# EasyEDA Pro project ProProject_Hauptplatine_ESP32.epro, schematic Ausgelagert
Create Date: 2024-05-03; Page Name: P1; Project Name: Hauptplatine_ESP32; Schematic Name: Ausgelagert; Update Date: 2024-05-03; Company: EasyEDA.com; Drawn: EasyEDA; Page Size: A4; Part Number: JLCPCB-002; Reviewed: EasyEDA; Version: V0.1
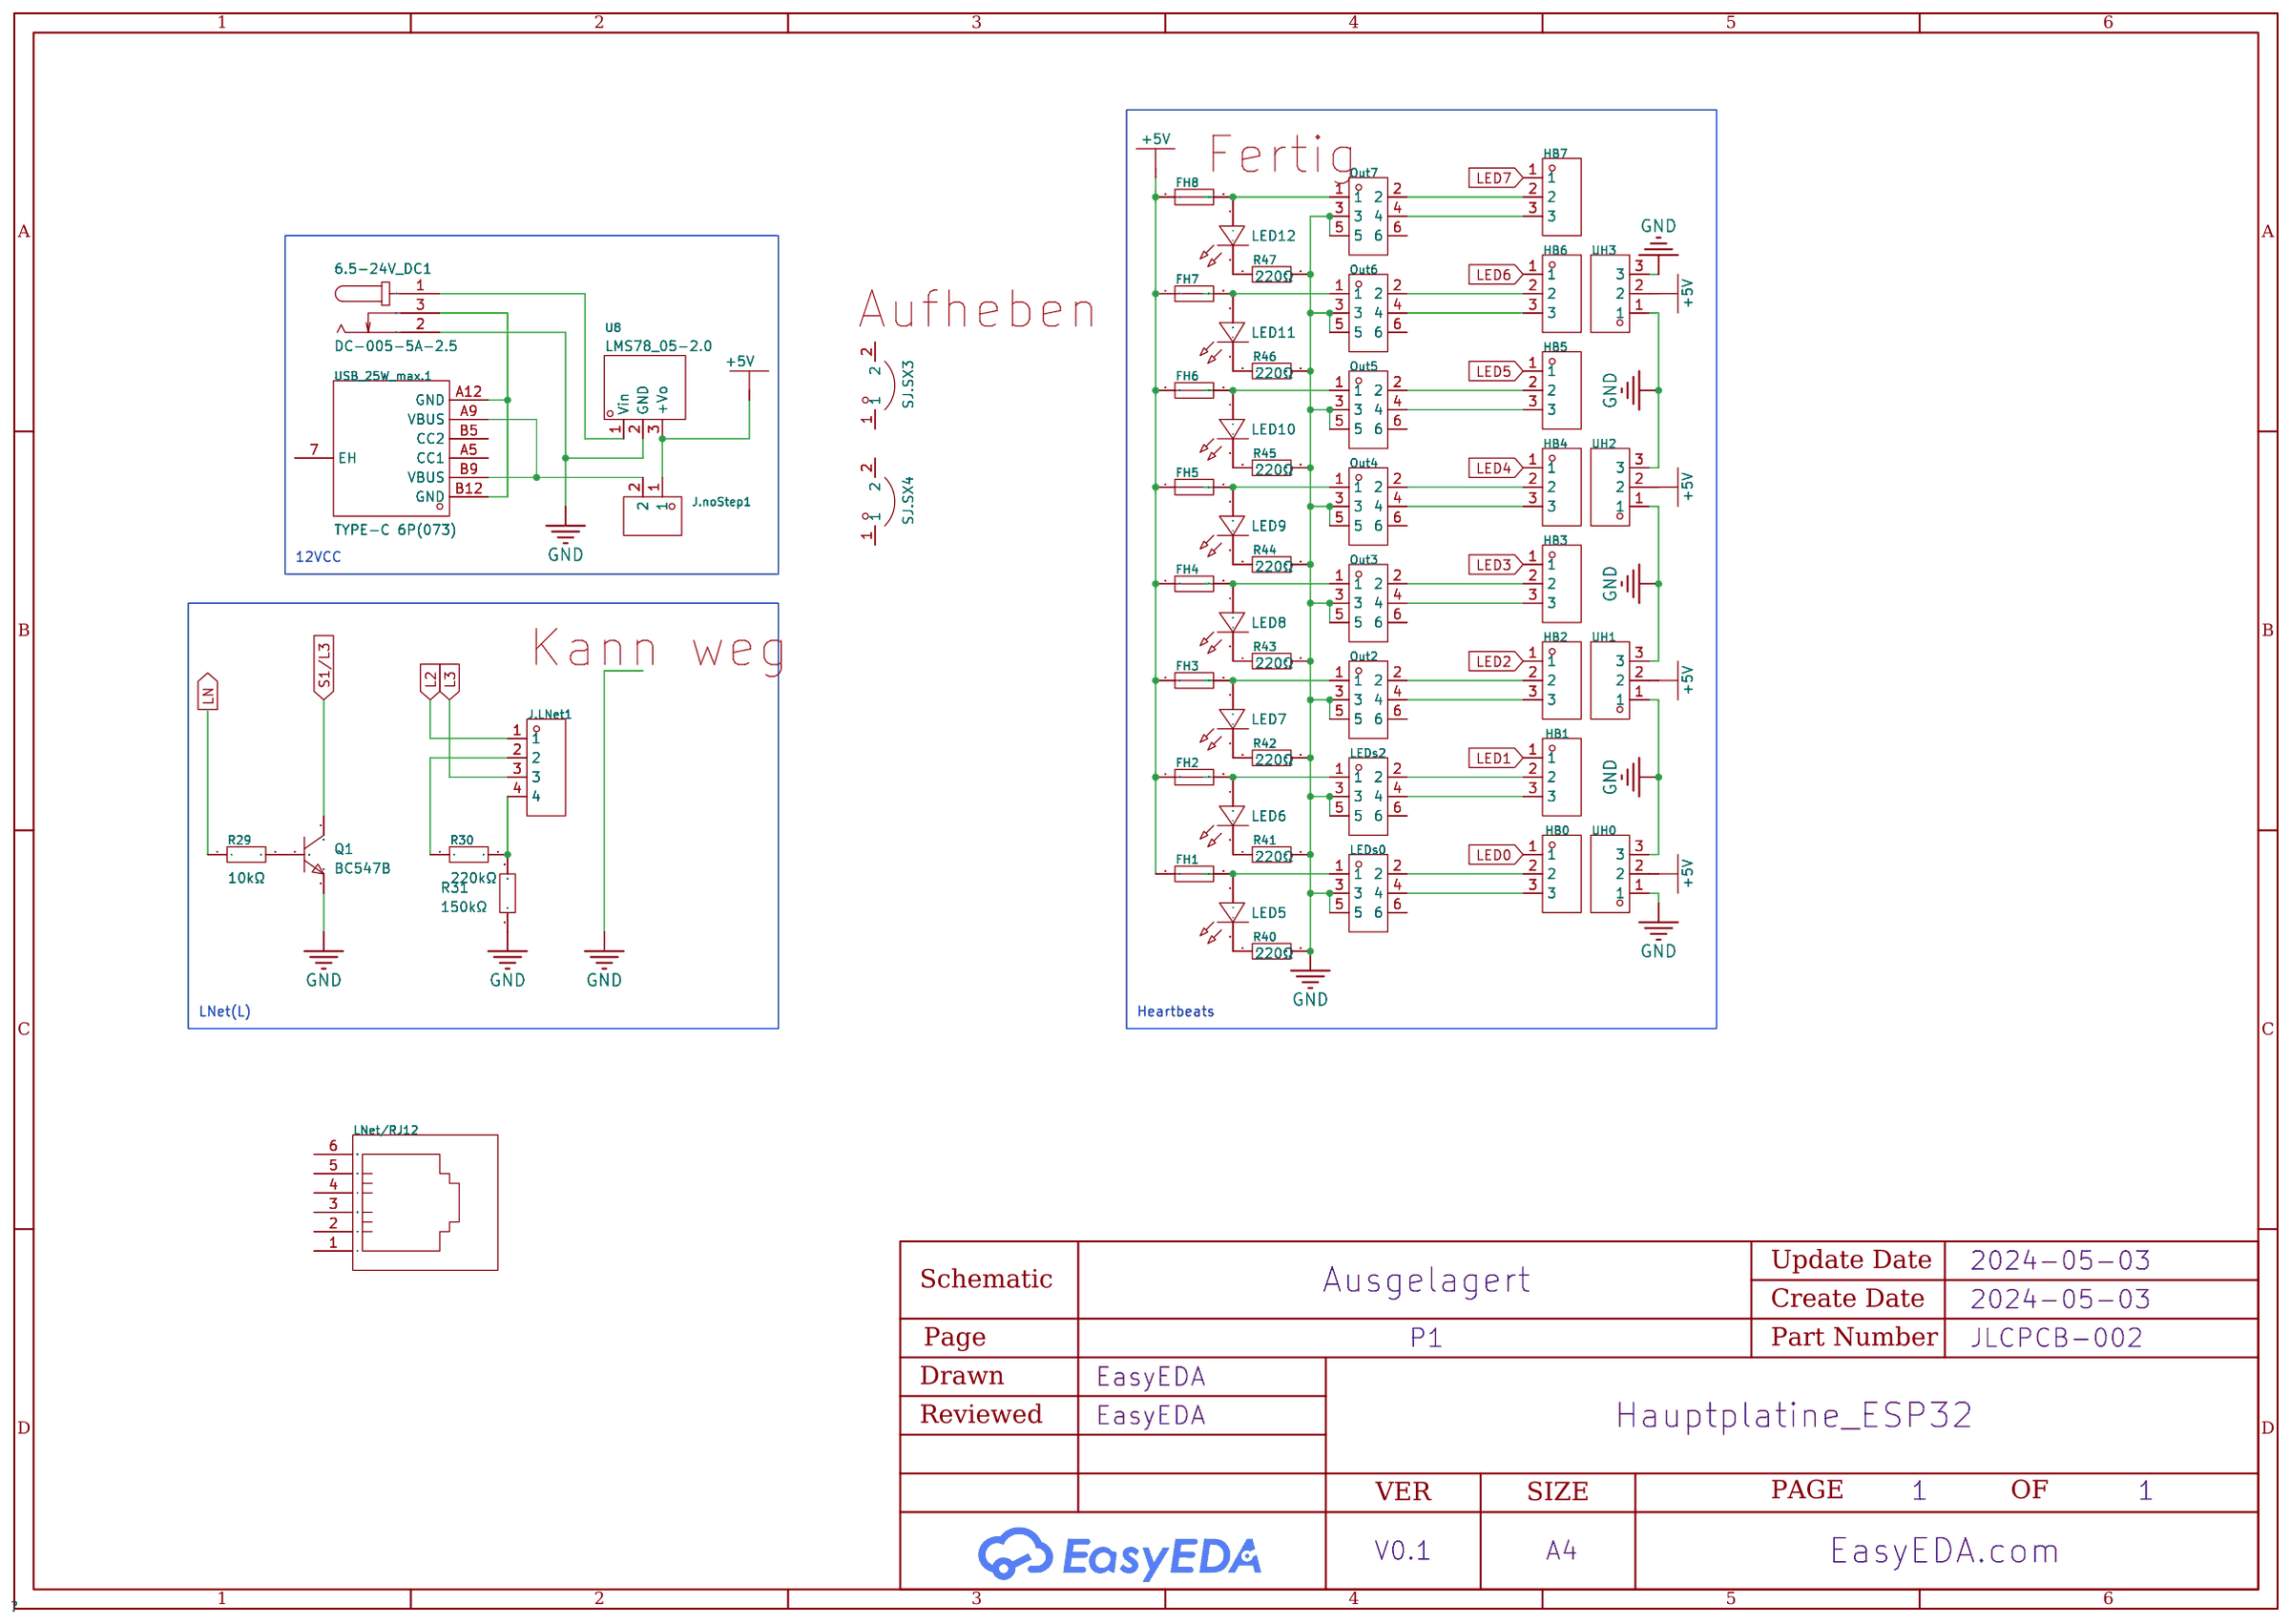
[diagram p6: schematic sheet]

## Parts
6.5-24V_DC1  DC-005-5A-2.5  [DC-IN-TH_DC-005-5A-2.5]
FH1  01550900M  [FUSE-SMD_L9.8-W5.0]
FH2  01550900M  [FUSE-SMD_L9.8-W5.0]
FH3  01550900M  [FUSE-SMD_L9.8-W5.0]
FH4  01550900M  [FUSE-SMD_L9.8-W5.0]
FH5  01550900M  [FUSE-SMD_L9.8-W5.0]
FH6  01550900M  [FUSE-SMD_L9.8-W5.0]
FH7  01550900M  [FUSE-SMD_L9.8-W5.0]
FH8  01550900M  [FUSE-SMD_L9.8-W5.0]
HB0  PM2.54-1*3  [HDR-TH_3P-P2.54-V-F]
HB1  PM2.54-1*3  [HDR-TH_3P-P2.54-V-F]
HB2  PM2.54-1*3  [HDR-TH_3P-P2.54-V-F]
HB3  PM2.54-1*3  [HDR-TH_3P-P2.54-V-F]
HB4  PM2.54-1*3  [HDR-TH_3P-P2.54-V-F]
HB5  PM2.54-1*3  [HDR-TH_3P-P2.54-V-F]
HB6  PM2.54-1*3  [HDR-TH_3P-P2.54-V-F]
HB7  PM2.54-1*3  [HDR-TH_3P-P2.54-V-F]
J.LNet1  PZ254V-11-04P  [HDR-TH_4P-P2.54-V-M]
J.noStep1  PZ254V-11-02P  [HDR-TH_2P-P2.54-V-M]
LED5  SZYY1206G  [LED1206-R-RD]
LED6  SZYY1206G  [LED1206-R-RD]
LED7  SZYY1206G  [LED1206-R-RD]
LED8  SZYY1206G  [LED1206-R-RD]
LED9  SZYY1206G  [LED1206-R-RD]
LED10  SZYY1206G  [LED1206-R-RD]
LED11  SZYY1206G  [LED1206-R-RD]
LED12  SZYY1206G  [LED1206-R-RD]
LEDs0  BH254V-6P  [IDC-TH_6P-P2.54-V-R2-C3-S2.54]
LEDs2  BH254V-6P  [IDC-TH_6P-P2.54-V-R2-C3-S2.54]
LNet/RJ12  DS1133-S60BPX  [RJ11-TH_DS1133-S60BPX]
Out2  BH254V-6P  [IDC-TH_6P-P2.54-V-R2-C3-S2.54]
Out3  BH254V-6P  [IDC-TH_6P-P2.54-V-R2-C3-S2.54]
Out4  BH254V-6P  [IDC-TH_6P-P2.54-V-R2-C3-S2.54]
Out5  BH254V-6P  [IDC-TH_6P-P2.54-V-R2-C3-S2.54]
Out6  BH254V-6P  [IDC-TH_6P-P2.54-V-R2-C3-S2.54]
Out7  BH254V-6P  [IDC-TH_6P-P2.54-V-R2-C3-S2.54]
Q1  BC547B  [TO-92-3_L4.9-W3.7-P1.27-L]
R29  10kΩ  [R1206]
R30  220kΩ  [R1206]
R31  150kΩ  [R1206]
R40  220Ω  [R1206]
R41  220Ω  [R1206]
R42  220Ω  [R1206]
R43  220Ω  [R1206]
R44  220Ω  [R1206]
R45  220Ω  [R1206]
R46  220Ω  [R1206]
R47  220Ω  [R1206]
SJ.SX3  SJ_1.27  [SMD_2P-P1.27-SJ]
SJ.SX4  SJ_1.27  [SMD_2P-P1.27-SJ]
U8  LMS78_05-2.0  [PWRM-TH_K78XX-500R3]
UH0  PM2.54-1*3  [HDR-TH_3P-P2.54-V-F]
UH1  PM2.54-1*3  [HDR-TH_3P-P2.54-V-F]
UH2  PM2.54-1*3  [HDR-TH_3P-P2.54-V-F]
UH3  PM2.54-1*3  [HDR-TH_3P-P2.54-V-F]
USB_25W_max.1  TYPE-C 6P(073)  [TYPE-C-SMD_TYPE-C-6P]

## Library data of the parts
6.5-24V_DC1 = DC-005-5A-2.5: Connector Type:DC Power Receptacle Inside Contact Diameter:2.5mm Outside Contact Diameter:6.5mm Current Rating (Max):5A Voltage Rating (Max):24V Contact Material:Brass Operating Temperature Range:-20℃~+70℃ Operating Temperature Range:-20℃~+70℃ Soldering T; LCSC Part Name: DC电源插座 内径:2.5mm 外径:6.5mm; Supplier Part: C381115; Manufacturer: XKB Connectivity(中国星坤); Supplier Footprint: 插件; JLCPCB Part Class: Extended Part; Datasheet: https://atta.szlcsc.com/upload/public/pdf/source/20220930/9F6B678D272419D8FE16D336E354A545.pdf; Supplier: LCSC; Connector Type: DC Power Receptacle; Inside Contact Diameter: 2.5mm; Outside Contact Diameter: 6.5mm; Current Rating (Max): 5A; Voltage Rating (Max): 24V; Contact Material: Brass; Operating Temperature Range: -20℃~+70℃; Soldering Temperature(Max): 260℃
FH1-FH8 = 01550900M: Fuseholder Type:- Fuse Type:- Fuse Size:-; Supplier Part: C108518; Manufacturer: Littelfuse(美国力特); Supplier Footprint: SMD,5.0x9.7mm; JLCPCB Part Class: Extended Part; Datasheet: https://atta.szlcsc.com/upload/public/pdf/source/20181031/C315847_D8C8759CD5ED576C0EA975A2D5312378.pdf; Supplier: LCSC
HB0-HB7 UH0-UH3 = PM2.54-1*3: Holes Structure:1x3P Pitch:2.54mm Row Spacing:2.54mm Circular Hole / Square Hole:方孔 Mounting Type:Straight Number of Rows:Plugin Number of Holes:3P Current Rating (Max):2.5A Holes Direction:Top Insulation Height:8.5mm Operating Temperature Range:-40℃~+105; LCSC Part Name: 间距:2.54mm 1x3P 直插; Supplier Part: C5116529; Manufacturer: ZHOURI(洲日); Supplier Footprint: 插件,P=2.54mm; JLCPCB Part Class: Extended Part; Datasheet: https://atta.szlcsc.com/upload/public/pdf/source/20220729/0B9CDCB2053AD78CED9CDFEF888323E9.pdf; Supplier: LCSC; Holes Structure: 1x3P; Pitch: 2.54mm; Row Spacing: 2.54mm; Circular Hole / Square Hole: 方孔; Mounting Type: Straight; Number of Rows: Plugin; Number of Holes: 3P; Current Rating (Max): 2.5A; Holes Direction: Top; Insulation Height: 8.5mm; Operating Temperature Range: -40℃~+105℃
J.LNet1 = PZ254V-11-04P: Pin Structure:1x4P Pitch:2.54mm Row Spacing:- Circluar Pins/Square Pins:Square Pins Mounting Type:Straight Number of Rows:Plugin Number of Pins:4P Current Rating (Max):3A Voltage Rating (Max):250V Length of Mating Pin:6mm Insulation Height:2.5mm Length of; LCSC Part Name: 间距:2.54mm 1x4P 直插 方针; Supplier Part: C2691448; Manufacturer: XFCN(兴飞); Supplier Footprint: 插件,P=2.54mm; JLCPCB Part Class: Extended Part; Datasheet: https://atta.szlcsc.com/upload/public/pdf/source/20200309/C492403_F9F19131791D08044AD4F84F8E751A34.pdf; Supplier: LCSC; Pin Structure: 1x4P; Pitch: 2.54mm; Circluar Pins/Square Pins: Square Pins; Mounting Type: Straight; Number of Rows: Plugin; Number of Pins: 4P; Current Rating (Max): 3A; Voltage Rating (Max): 250V; Length of Mating Pin: 6mm; Insulation Height: 2.5mm; Length of End Connection Pin: 3mm; Operating Temperature Range: -40℃~+105℃; Color: Black
J.noStep1 = PZ254V-11-02P: Pin Structure:1x2P Pitch:2.54mm Row Spacing:- Circluar Pins/Square Pins:Square Pins Mounting Type:Straight Number of Rows:Plugin Number of Pins:2P Current Rating (Max):- Voltage Rating (Max):- Length of Mating Pin:6mm Insulation Height:2.5mm Length of End; LCSC Part Name: 间距:2.54mm 1x2P 直插 方针; Supplier Part: C492401; Manufacturer: XFCN(兴飞); Supplier Footprint: 插件,P=2.54mm; JLCPCB Part Class: Extended Part; Datasheet: https://atta.szlcsc.com/upload/public/pdf/source/20200309/C492401_A812433581A9B211A7FFA413ADDFF0E5.pdf; Supplier: LCSC; Pin Structure: 1x2P; Pitch: 2.54mm; Circluar Pins/Square Pins: Square Pins; Mounting Type: Straight; Number of Rows: Plugin; Number of Pins: 2P; Length of Mating Pin: 6mm; Insulation Height: 2.5mm; Length of End Connection Pin: 3mm; Operating Temperature Range: -40℃~+105℃; Color: Black
LED5-LED12 = SZYY1206G: Emitted Color:Emerald; LCSC Part Name: 翠绿; Supplier Part: C434439; Manufacturer: yongyu(永裕光电); Supplier Footprint: 1206; JLCPCB Part Class: Extended Part; Datasheet: https://atta.szlcsc.com/upload/public/pdf/source/20200628/C434439_0A6287F1EA2604FB8C8003896F01CB92.pdf; Supplier: LCSC; Emitted Color: Emerald
LEDs0 LEDs2 Out2-Out7 = BH254V-6P: Connector Type:简牛座 Pitch:2.54mm Structure:2x3P Current Rating (Max):3A Voltage Rating (Max):250V Holder Type:Straight Row Spacing:2.54mm Number of Rows:2 Pin Number in each Row:3 Operating Temperature Range:-40℃~+105℃ Operating Temperature Range:-40℃~+105; LCSC Part Name: 2.54mm 2x3P 排数:2 每排P数:3; Supplier Part: C492441; Manufacturer: XFCN(兴飞); Supplier Footprint: 插件,P=2.54mm; JLCPCB Part Class: Extended Part; Datasheet: https://atta.szlcsc.com/upload/public/pdf/source/20200312/C492444_4AABE2FC4F6BE8226B85135616AF0092.pdf; Supplier: LCSC; Connector Type: 简牛座; Pitch: 2.54mm; Structure: 2x3P; Current Rating (Max): 3A; Voltage Rating (Max): 250V; Holder Type: Straight; Row Spacing: 2.54mm; Number of Rows: 2; Pin Number in each Row: 3; Operating Temperature Range: -40℃~+105℃
LNet/RJ12 = DS1133-S60BPX: Connector Type:RJReceptacle USOC Codes:RJ12 Number of Ports:1 Shielding:- LED:- Ratings:-; LCSC Part Name: RJ12; Supplier Part: C77859; Manufacturer: CONNFLY; Supplier Footprint: 插件; JLCPCB Part Class: Extended Part; Datasheet: https://atta.szlcsc.com/upload/public/pdf/source/20180529/C77859_3164FC81ACC4F2D8B15A2684EF7DB4A9.pdf; Supplier: LCSC; Connector Type: RJReceptacle; USOC Codes: RJ12; Number of Ports: 1
Q1 = BC547B_C719806: Transistor Type: Collector Current (Ic): Collector-Emitter Breakdown Voltage (Vceo): Power Dissipation (Pd): DC Current Gain (hFE@Ic,Vce):200@2mA,5V DC Current Gain (hFE@Ic,Vce):200@2mA,5V Transition Frequency (fT):300MHz Collector Cut-Off Current (Icbo):; LCSC Part Name: 耐压:45V 电流:100mA NPN; Supplier Part: C719806; Manufacturer: onsemi(安森美); Supplier Footprint: TO-92-3; JLCPCB Part Class: Extended Part; Datasheet: https://atta.szlcsc.com/upload/public/pdf/source/20230915/4ABAAE35BBE891E62B9F2D68DC6BA32E.pdf; Supplier: LCSC; DC Current Gain (hFE@Ic,Vce): 200@2mA,5V; Transition Frequency (fT): 300MHz; Collector Cut-Off Current (Icbo): 15nA; Collector-Emitter Saturation Voltage (VCE(sat)@Ic,Ib): 600mV@5mA,100mA; Operating Temperature: -55℃~+150℃@(Tj)
R29 = 1206W4F1002T5E: Type:Thick Film Resistors Resistance:10kΩ Tolerance:±1% Tolerance:±1% Power(Watts): Overload Voltage (Max): Temperature Coefficient:±100ppm/℃ Temperature Coefficient:±100ppm/℃ Operating Temperature Range:-55℃~+155℃ Operating Temperature Range:-55℃~+155℃; LCSC Part Name: 10kΩ ±1% 250mW 厚膜电阻; Supplier Part: C17902; Manufacturer: UNI-ROYAL(厚声); Supplier Footprint: 1206; JLCPCB Part Class: Basic Part; Datasheet: https://atta.szlcsc.com/upload/public/pdf/source/20200306/C422600_1E6D84923E4A46A82E41ADD87F860B5C.pdf; Supplier: LCSC; Type: Thick Film Resistors; Tolerance: ±1%; Temperature Coefficient: ±100ppm/℃; Operating Temperature Range: -55℃~+155℃
R30 = 1206W4F2203T5E: Type:Thick Film Resistors Resistance:220kΩ Tolerance:±1% Tolerance:±1% Power(Watts): Overload Voltage (Max): Temperature Coefficient:±100ppm/℃ Temperature Coefficient:±100ppm/℃ Operating Temperature Range:-55℃~+155℃ Operating Temperature Range:-55℃~+155℃; LCSC Part Name: 220kΩ ±1% 250mW 厚膜电阻; Supplier Part: C17956; Manufacturer: UNI-ROYAL(厚声); Supplier Footprint: 1206; JLCPCB Part Class: Extended Part; Datasheet: https://atta.szlcsc.com/upload/public/pdf/source/20200306/C422600_1E6D84923E4A46A82E41ADD87F860B5C.pdf; Supplier: LCSC; Type: Thick Film Resistors; Tolerance: ±1%; Temperature Coefficient: ±100ppm/℃; Operating Temperature Range: -55℃~+155℃
R31 = 1206W4F1503T5E: Type:Thick Film Resistors Resistance:150kΩ Tolerance:±1% Tolerance:±1% Power(Watts): Overload Voltage (Max): Temperature Coefficient:±100ppm/℃ Temperature Coefficient:±100ppm/℃ Operating Temperature Range:-55℃~+155℃ Operating Temperature Range:-55℃~+155℃; LCSC Part Name: 150kΩ ±1% 250mW 厚膜电阻; Supplier Part: C17916; Manufacturer: UNI-ROYAL(厚声); Supplier Footprint: 1206; JLCPCB Part Class: Extended Part; Datasheet: https://atta.szlcsc.com/upload/public/pdf/source/20200306/C422600_1E6D84923E4A46A82E41ADD87F860B5C.pdf; Supplier: LCSC; Type: Thick Film Resistors; Tolerance: ±1%; Temperature Coefficient: ±100ppm/℃; Operating Temperature Range: -55℃~+155℃
R40-R47 = 1206W4J0221T5E: Type:Thick Film Resistors Resistance: Tolerance:±5% Tolerance:±5% Power(Watts): Overload Voltage (Max): Temperature Coefficient:±100ppm/℃ Temperature Coefficient:±100ppm/℃ Operating Temperature Range:-55℃~+155℃ Operating Temperature Range:-55℃~+155℃; LCSC Part Name: 220Ω ±5% 250mW 厚膜电阻; Supplier Part: C25363; Manufacturer: UNI-ROYAL(厚声); Supplier Footprint: 1206; JLCPCB Part Class: Extended Part; Datasheet: https://atta.szlcsc.com/upload/public/pdf/source/20200306/C422600_1E6D84923E4A46A82E41ADD87F860B5C.pdf; Supplier: LCSC; Type: Thick Film Resistors; Tolerance: ±5%; Temperature Coefficient: ±100ppm/℃; Operating Temperature Range: -55℃~+155℃
SJ.SX3 SJ.SX4 = SJ-raily74: Pin Structure:1x2P Pitch:1.27mm Row Spacing:1.27mm Circluar Pins/Square Pins:Square Pins Mounting Type:- Number of Rows:Plugin Number of Pins:2P Current Rating (Max):1A Voltage Rating (Max):250V Length of Mating Pin:1.8mm Insulation Height:1mm Length of E; LCSC Part Name: 1x2P 间距:1.27mm 方针; Supplier Part: C2881569; Manufacturer: XKB Connection(中国星坤); Supplier Footprint: SMD,P=1.27mm(交错脚); JLCPCB Part Class: Extended Part; Supplier: LCSC; Pin Structure: 1x2P; Pitch: 1.27mm; Row Spacing: 1.27mm; Circluar Pins/Square Pins: Square Pins; Number of Rows: Plugin; Number of Pins: 2P; Current Rating (Max): 1A; Voltage Rating (Max): 250V; Length of Mating Pin: 1.8mm; Insulation Height: 1mm; Length of End Connection Pin: 4.2mm; Contact Plating: Gold; Operating Temperature Range: -40℃~+105℃; Soldering Temperature(Max): 260℃; Color: Black
U8 = K7805-500R3_C909662: Conversion Type:DC-DC Input Voltage(DC):6V~36V Input Voltage(DC):6V~36V Output Voltage:5V Output Voltage:5V Output Current (Max):500mA Output Current (Max):500mA Function:- Output Channel:1; LCSC Part Name: K7805-500R3; Supplier Part: C909662; Manufacturer: DEXU(德旭电子); Manufacturer Part: K7805-500R3; Supplier Footprint: 插件; JLCPCB Part Class: Extended Part; Datasheet: https://atta.szlcsc.com/upload/public/pdf/source/20201117/C909662_B77209BD6C81EDDF768B71BCFC4F182D.pdf; Supplier: LCSC; Conversion Type: DC-DC; Input Voltage(DC): 6V~36V; Output Voltage: 5V; Output Current (Max): 500mA; Output Channel: 1
USB_25W_max.1 = TYPE-C 6P(073): Connector Type:Type-C Standard:- Gender:Female Number of Ports:1 Number of Contacts:6P Mounting Style:卧贴 Current Rating - Power (Max):5A Operating Temperature Range:-25℃~+85℃ Operating Temperature Range:-25℃~+85℃; LCSC Part Name: Type-C 母 卧贴; Supplier Part: C668623; Manufacturer: SHOU HAN(首韩); Supplier Footprint: SMD; JLCPCB Part Class: Extended Part; Datasheet: https://atta.szlcsc.com/upload/public/pdf/source/20200618/C668623_A4B260DED7AC1949BAC6AE39E9F4CD80.pdf; Supplier: LCSC; Connector Type: Type-C; Gender: Female; Number of Ports: 1; Number of Contacts: 6P; Mounting Style: 卧贴; Current Rating - Power (Max): 5A; Operating Temperature Range: -25℃~+85℃

## Nets
+5V: FH1.1 FH2.1 FH3.1 FH4.1 FH5.1 FH6.1 FH7.1 FH8.1 J.noStep1.1 U8.3(+Vo) UH0.2 UH1.2 UH2.2 UH3.2
GND: 6.5-24V_DC1.2 LEDs0.3 LEDs0.5 LEDs2.3 LEDs2.5 Out2.3 Out2.5 Out3.3 Out3.5 Out4.3 Out4.5 Out5.3 Out5.5 Out6.3 Out6.5 Out7.3 Out7.5 Q1.3(E) R31.1 R40.2 R41.2 R42.2 R43.2 R44.2 R45.2 R46.2 R47.2 U8.2(GND) UH0.1 UH0.3 UH1.1 UH1.3 UH2.1 UH2.3 UH3.1 UH3.3
L2: J.LNet1.1
L3: J.LNet1.3
LED0: HB0.1
LED1: HB1.1
LED2: HB2.1
LED3: HB3.1
LED4: HB4.1
LED5: HB5.1
LED6: HB6.1
LED7: HB7.1
LN: R29.1
S1/L3: Q1.1(C)
Net-(6.5-24V_DC1-1): 6.5-24V_DC1.1 U8.1(Vin)
Net-(6.5-24V_DC1-3): 6.5-24V_DC1.3 USB_25W_max.1.A12(GND) USB_25W_max.1.B12(GND)
Net-(FH1-2): FH1.2 LED5.1(+) LEDs0.1
Net-(FH2-2): FH2.2 LED6.1(+) LEDs2.1
Net-(FH3-2): FH3.2 LED7.1(+) Out2.1
Net-(FH4-2): FH4.2 LED8.1(+) Out3.1
Net-(FH5-2): FH5.2 LED9.1(+) Out4.1
Net-(FH6-2): FH6.2 LED10.1(+) Out5.1
Net-(FH7-2): FH7.2 LED11.1(+) Out6.1
Net-(FH8-2): FH8.2 LED12.1(+) Out7.1
Net-(HB0-2): HB0.2 LEDs0.2
Net-(HB0-3): HB0.3 LEDs0.4
Net-(HB1-2): HB1.2 LEDs2.2
Net-(HB1-3): HB1.3 LEDs2.4
Net-(HB2-2): HB2.2 Out2.2
Net-(HB2-3): HB2.3 Out2.4
Net-(HB3-2): HB3.2 Out3.2
Net-(HB3-3): HB3.3 Out3.4
Net-(HB4-2): HB4.2 Out4.2
Net-(HB4-3): HB4.3 Out4.4
Net-(HB5-2): HB5.2 Out5.2
Net-(HB5-3): HB5.3 Out5.4
Net-(HB6-2): HB6.2 Out6.2
Net-(HB6-3): HB6.3 Out6.4
Net-(HB7-2): HB7.2 Out7.2
Net-(HB7-3): HB7.3 Out7.4
Net-(J.LNet1-2): J.LNet1.2 R30.1
Net-(J.LNet1-4): J.LNet1.4 R30.2 R31.2
Net-(J.noStep1-2): J.noStep1.2 USB_25W_max.1.A9(VBUS) USB_25W_max.1.B9(VBUS)
Net-(LED5-2): LED5.2(-) R40.1
Net-(LED6-2): LED6.2(-) R41.1
Net-(LED7-2): LED7.2(-) R42.1
Net-(LED8-2): LED8.2(-) R43.1
Net-(LED9-2): LED9.2(-) R44.1
Net-(LED10-2): LED10.2(-) R45.1
Net-(LED11-2): LED11.2(-) R46.1
Net-(LED12-2): LED12.2(-) R47.1
Net-(Q1-2): Q1.2(B) R29.2

Not connected (* = marked no-connect by the designer): LEDs0 6; LEDs2 6; LNet/RJ12 1 2 3 4 5 6; Out2 6; Out3 6; Out4 6; Out5 6; Out6 6; Out7 6; SJ.SX3 1 2; SJ.SX4 1 2; USB_25W_max.1 7(EH) A5(CC1) B5(CC2)

## Notes on the sheet
- Fertig
- Aufheben
- 12VCC
- Kann weg
- LNet(L)
- Heartbeats
